# Altium schematic sheet Main.SchDoc
size A
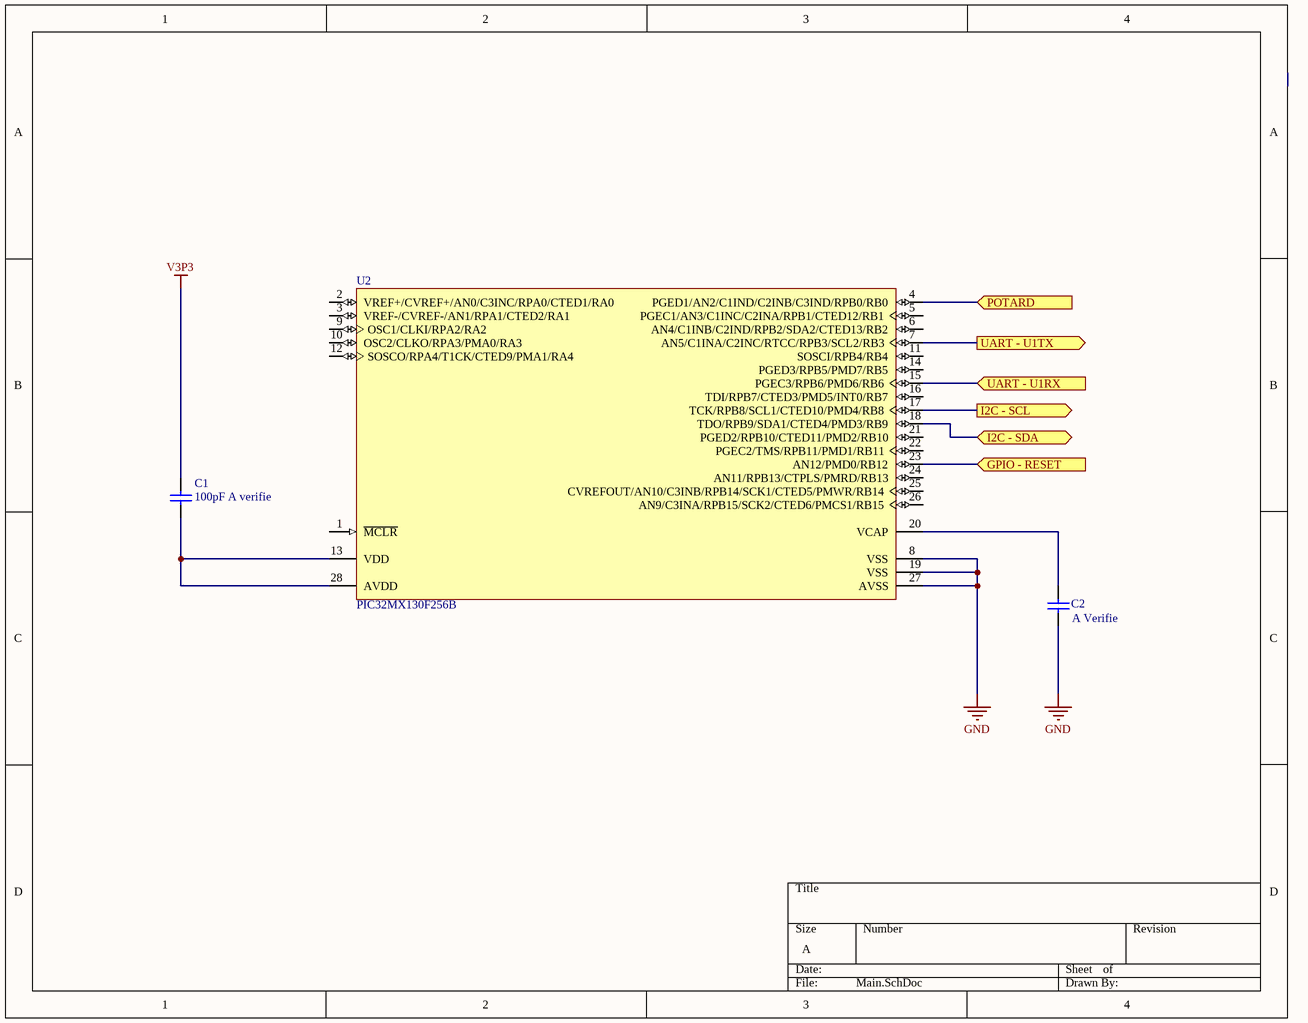
[diagram p0: Main.SchDoc]

## Parts
C1  value 100pF A verifie  [CAP 0603]  (hidden comment: Cap)
C2  value A Verifie  [CAP 0603]  (hidden comment: Cap)
U2  PIC32MX130F256B  [PIC32MX130F256B]

## Ports
GPIO - RESET (in), I2C - SCL (out), I2C - SDA (bidir), POTARD (in), UART - U1RX (in), UART - U1TX (out)

## Nets
GND: C2.1 U2.8(VSS) U2.19(VSS) U2.27(AVSS)
V3P3: C1.2
GPIO - RESET: U2.23(AN12/PMD0/RB12) ; port GPIO - RESET
I2C - SCL: U2.17(TCK/RPB8/SCL1/CTED10/PMD4/RB8) ; port I2C - SCL
I2C - SDA: U2.18(TDO/RPB9/SDA1/CTED4/PMD3/RB9) ; port I2C - SDA
POTARD: U2.4(PGED1/AN2/C1IND/C2INB/C3IND/RPB0/RB0) ; port POTARD
UART - U1RX: U2.15(PGEC3/RPB6/PMD6/RB6) ; port UART - U1RX
UART - U1TX: U2.7(AN5/C1INA/C2INC/RTCC/RPB3/SCL2/RB3) ; port UART - U1TX
NetC1_1: C1.1 U2.13(VDD) U2.28(AVDD)
NetC2_2: C2.2 U2.20(VCAP)

Not connected (* = marked no-connect by the designer): U2 1(~{MCLR}) 2(VREF+/CVREF+/AN0/C3INC/RPA0/CTED1/RA0) 3(VREF-/CVREF-/AN1/RPA1/CTED2/RA1) 5(PGEC1/AN3/C1INC/C2INA/RPB1/CTED12/RB1) 6(AN4/C1INB/C2IND/RPB2/SDA2/CTED13/RB2) 9(OSC1/CLKI/RPA2/RA2) 10(OSC2/CLKO/RPA3/PMA0/RA3) 11(SOSCI/RPB4/RB4) 12(SOSCO/RPA4/T1CK/CTED9/PMA1/RA4) 14(PGED3/RPB5/PMD7/RB5) 16(TDI/RPB7/CTED3/PMD5/INT0/RB7) 21(PGED2/RPB10/CTED11/PMD2/RB10) 22(PGEC2/TMS/RPB11/PMD1/RB11) 24(AN11/RPB13/CTPLS/PMRD/RB13) 25(CVREFOUT/AN10/C3INB/RPB14/SCK1/CTED5/PMWR/RB14) 26(AN9/C3INA/RPB15/SCK2/CTED6/PMCS1/RB15)

## Library data of the parts
C1 C2 = Cap: Capacitor; Published: 8-Jun-2000; LatestRevisionDate: 17-Jul-2002; LatestRevisionNote: Re-released for DXP Platform.; PackageReference: RAD-0.3; Publisher: Altium Limited; PackageDescription: Radial Cap, Thru-Hole; 2 Leads; 0.3 in Pin Spacing
U2 = PIC32MX130F256B: PIC32MX Family Microcontroller; Package: SOIC